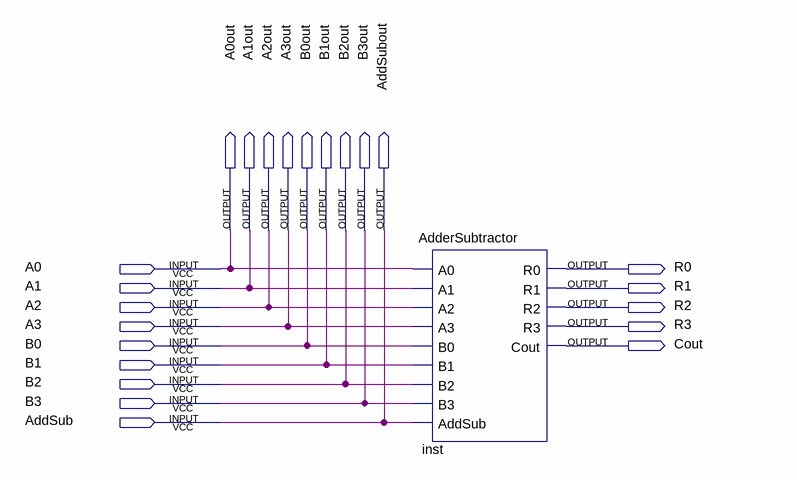
[diagram p0: schematic sheet]
// Quartus schematic Lab5AddSub.bdf as structural Verilog: 1 symbols, 23 pins
module Lab5AddSub (
  input  A0,
  input  A1,
  input  A2,
  input  A3,
  input  B0,
  input  B1,
  input  B2,
  input  B3,
  input  AddSub,
  output A0out,
  output A1out,
  output A2out,
  output A3out,
  output B0out,
  output B1out,
  output B2out,
  output B3out,
  output AddSubout,
  output R0,
  output R1,
  output R2,
  output R3,
  output Cout
);

  AdderSubtractor inst (
    .A0(A0), .A1(A1), .A2(A2), .A3(A3), .B0(B0), .B1(B1), .B2(B2), .B3(B3), .AddSub(AddSub), .R0(R0),
    .R1(R1), .R2(R2), .R3(R3), .Cout(Cout));

  assign A0out = A0;
  assign A1out = A1;
  assign A2out = A2;
  assign A3out = A3;
  assign AddSubout = AddSub;
  assign B0out = B0;
  assign B1out = B1;
  assign B2out = B2;
  assign B3out = B3;
endmodule
